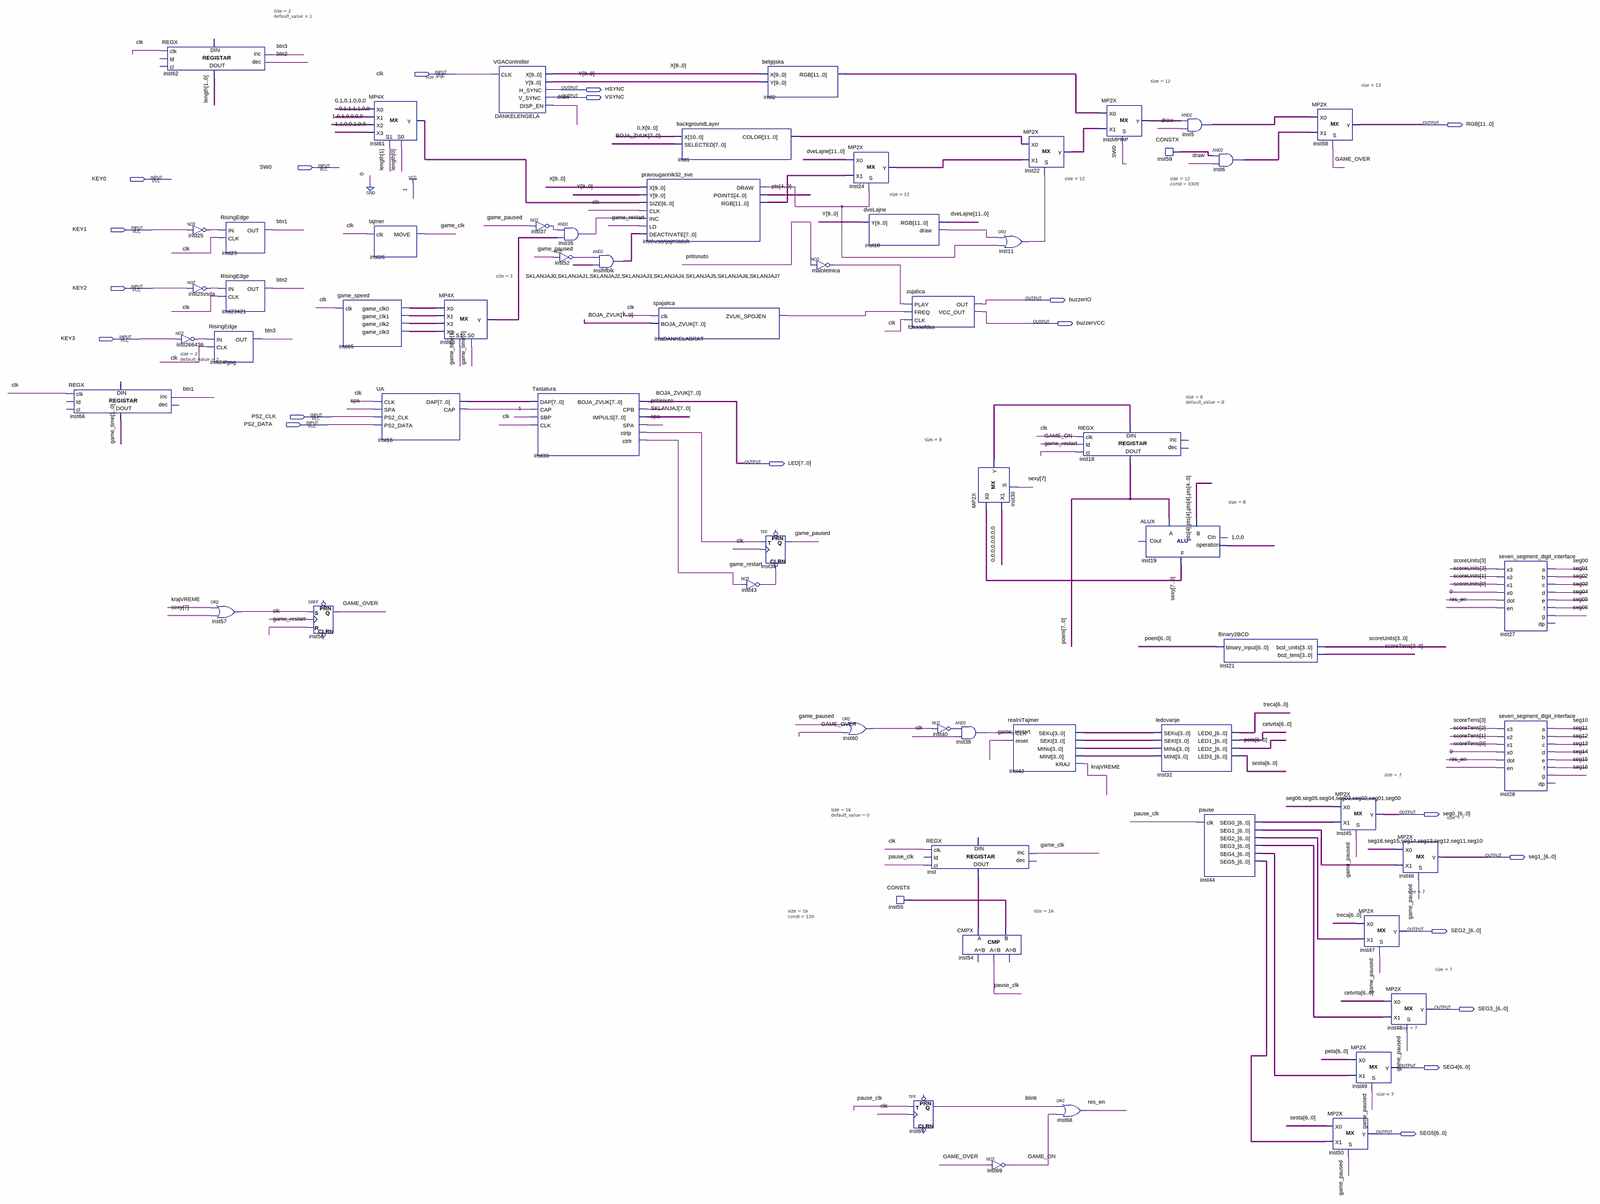
[diagram p0: schematic sheet, whole]
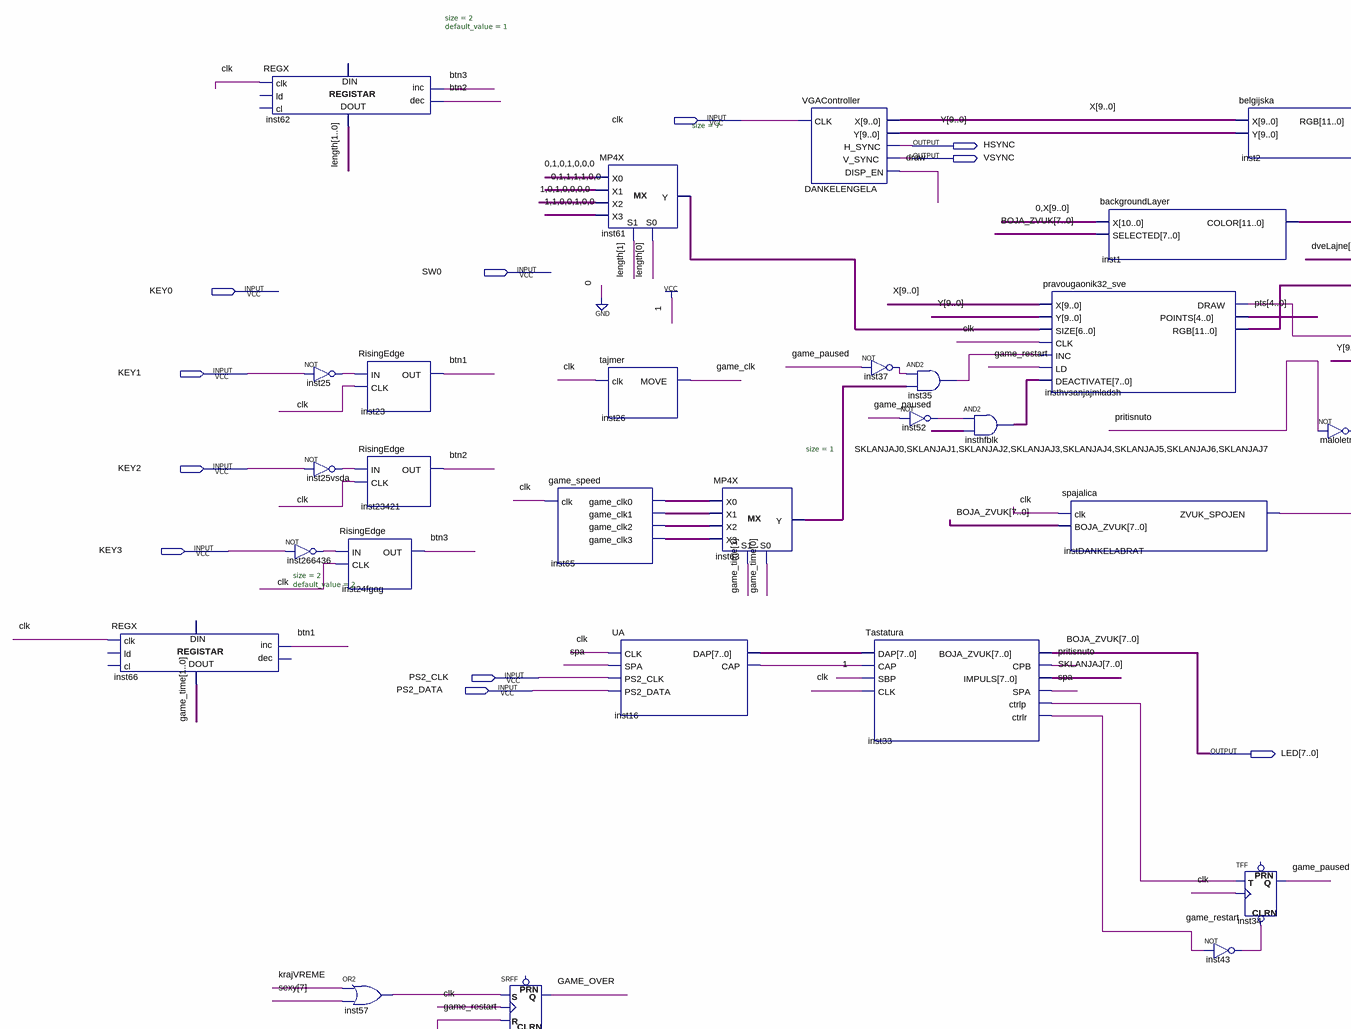
[diagram p1: schematic sheet, upper left part]
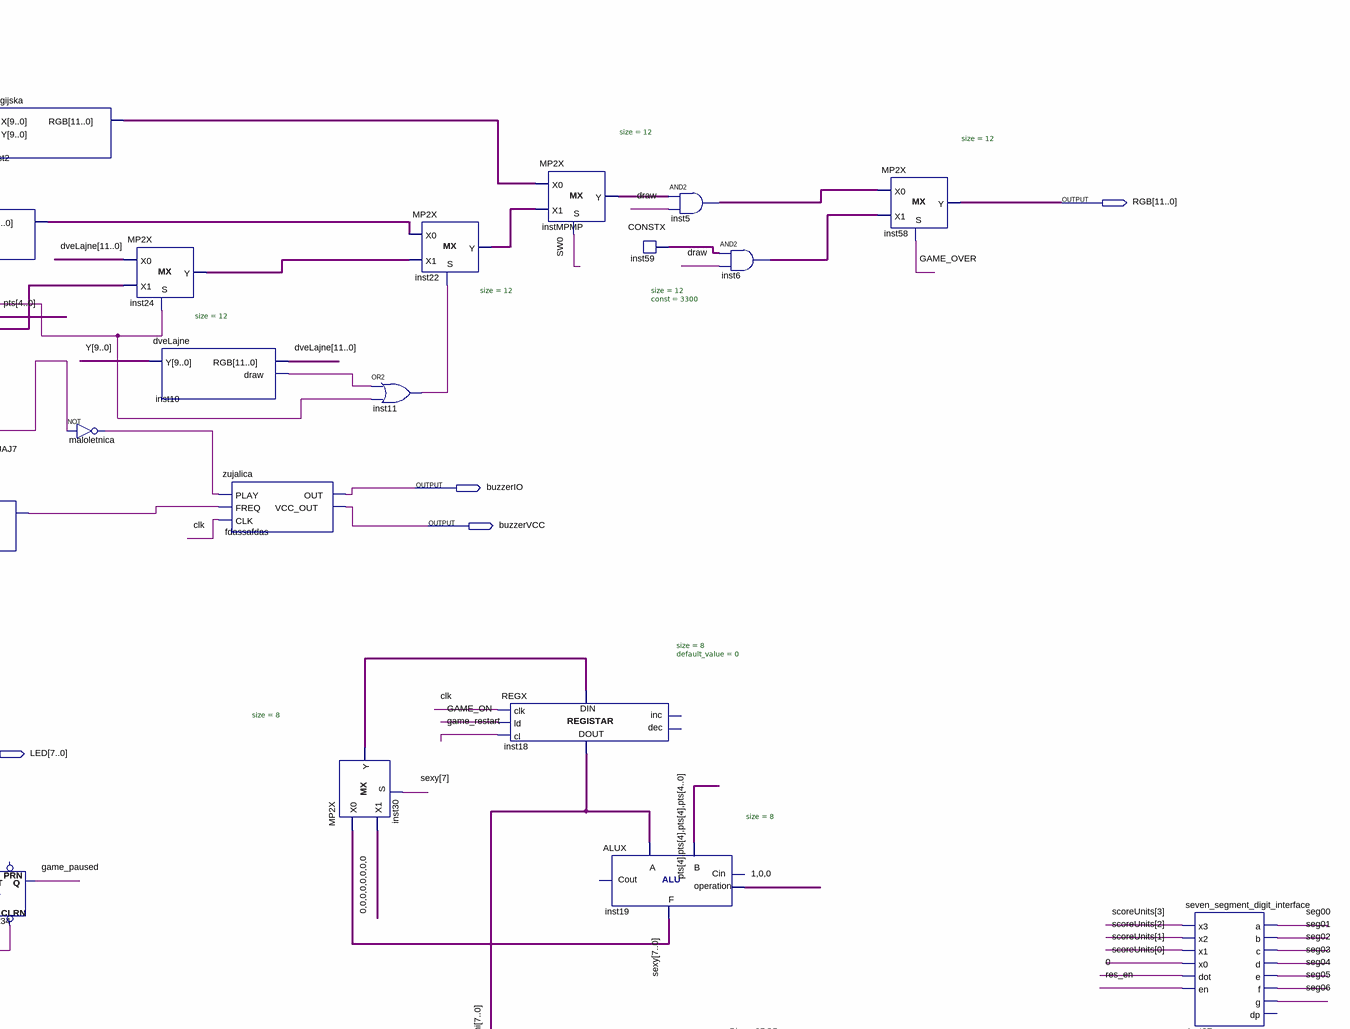
[diagram p2: schematic sheet, upper right part]
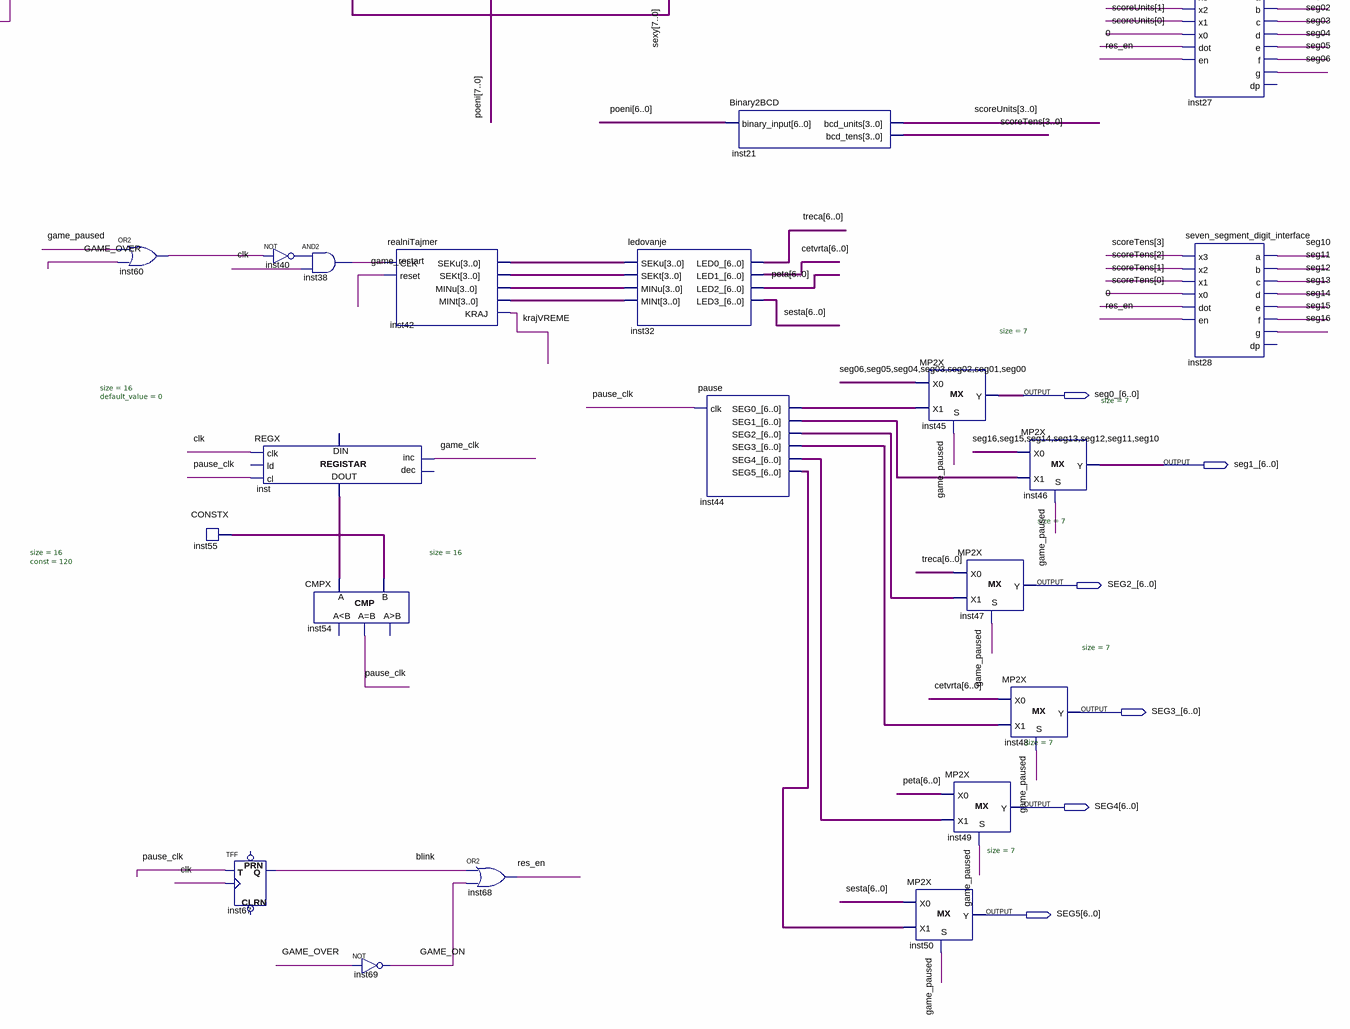
[diagram p3: schematic sheet, lower right part]
// Quartus schematic main.bdf as structural Verilog: 62 symbols, 20 pins
module main (
  input  clk,
  input  SW0,
  input  KEY0,
  input  KEY1,
  input  KEY2,
  input  KEY3,
  input  PS2_CLK,
  input  PS2_DATA,
  output HSYNC,
  output VSYNC,
  output [11:0] RGB,
  output buzzerIO,
  output buzzerVCC,
  output [7:0] LED,
  output [6:0] seg0_,
  output [6:0] seg1_,
  output [6:0] SEG2_,
  output [6:0] SEG3_,
  output [6:0] SEG4,
  output [6:0] SEG5
);

  wire blink, btn1, btn2, btn3, draw, game_clk, GAME_ON, GAME_OVER, game_paused, game_restart, inst10_draw,
       inst11_out, inst16_cap, inst25_out, inst25vsda_out, inst33_ctrlp, inst35_out, inst37_out, inst38_out,
       inst40_out, inst43_out, inst52_out, inst57_out, inst60_out, inst63_y, inst65_game_clk0,
       inst65_game_clk1, inst65_game_clk2, inst65_game_clk3, inst266436_out, instDANKELABRAT_zvuk_spojen,
       insthvsanjajmladsh_draw, krajVREME, maloletnica_out, pause_clk, pritisnuto, res_en, seg00, seg01,
       seg02, seg03, seg04, seg05, seg06, seg10, seg11, seg12, seg13, seg14, seg15, seg16, spa;
  wire [1:0] game_time, length;
  wire [3:0] inst42_mint, inst42_minu, inst42_sekt, inst42_seku, scoreTens, scoreUnits;
  wire [4:0] pts;
  wire [6:0] cetvrta, inst44_seg0_, inst44_seg1_, inst44_seg2_, inst44_seg3_, inst44_seg4_, inst44_seg5_,
       inst61_y, peta, sesta, treca;
  wire [7:0] inst16_dap, inst30_y, insthfblk_out, poeni, sexy, SKLANJAJ;
  wire [9:0] X, Y;
  wire [11:0] dveLajne, inst1_color, inst2_rgb, inst5_out, inst6_out, inst22_y, inst24_y, inst59_data,
       insthvsanjajmladsh_rgb, instMPMP_y;
  wire [15:0] inst55_data, inst_data_out;

  REGX #(.size(2), .default_value(2)) inst66 (
    .clk(clk), .inc(btn1), .data_out(game_time));  // open: ld, cl, dec, data_in
  REGX #(.size(2), .default_value(1)) inst62 (
    .clk(clk), .inc(btn3), .dec(btn2), .data_out(length));  // open: ld, cl, data_in
  not inst25 (inst25_out, KEY1);
  not inst25vsda (inst25vsda_out, KEY2);
  not inst266436 (inst266436_out, KEY3);
  RisingEdge inst23 (.IN(inst25_out), .CLK(clk), .OUT(btn1));
  RisingEdge inst23421 (.IN(inst25vsda_out), .CLK(clk), .OUT(btn2));
  RisingEdge inst24fgag (.IN(inst266436_out), .CLK(clk), .OUT(btn3));
  or inst57 (inst57_out, krajVREME, sexy[7]);
  SRFF inst56 (.S(inst57_out), .R(game_restart), .CLK(clk), .Q(GAME_OVER));  // open: PRN, CLRN
  game_speed inst65 (
    .clk(clk), .game_clk0(inst65_game_clk0), .game_clk1(inst65_game_clk1), .game_clk2(inst65_game_clk2),
    .game_clk3(inst65_game_clk3));
  MP4X #(.size(7)) inst61 (
    .S0(length[0]), .S1(length[1]), .X0(7'b0101000), .X1(7'b0111100), .X2(7'b1010000), .X3(7'b1100100),
    .Y(inst61_y));
  tajmer inst26 (.clk(clk), .MOVE(game_clk));
  UA inst16 (.CLK(clk), .SPA(spa), .PS2_CLK(PS2_CLK), .PS2_DATA(PS2_DATA), .DAP(inst16_dap), .CAP(inst16_cap));
  MP4X #(.size(1)) inst63 (
    .S0(game_time[0]), .S1(game_time[1]), .X0(inst65_game_clk0), .X1(inst65_game_clk1),
    .X2(inst65_game_clk2), .X3(inst65_game_clk3), .Y(inst63_y));
  VGAController DANKELENGELA (.CLK(clk), .X(X), .Y(Y), .H_SYNC(HSYNC), .V_SYNC(VSYNC), .DISP_EN(draw));
  not inst37 (inst37_out, game_paused);
  Tastatura inst33 (
    .DAP(inst16_dap), .CAP(inst16_cap), .SBP(1'b1), .CLK(clk), .BOJA_ZVUK(LED), .CPB(pritisnuto),
    .IMPULS(SKLANJAJ), .SPA(spa), .ctrlp(inst33_ctrlp), .ctrlr(game_restart));
  and inst35 (inst35_out, inst37_out, inst63_y);
  not inst52 (inst52_out, game_paused);
  assign insthfblk_out = {8{inst52_out}} & {SKLANJAJ[0], SKLANJAJ[1], SKLANJAJ[2], SKLANJAJ[3], SKLANJAJ[4], SKLANJAJ[5], SKLANJAJ[6], SKLANJAJ[7]};  // AND2 insthfblk, 8 bits wide
  pravougaonik32_sve insthvsanjajmladsh (
    .X(X), .Y(Y), .SIZE(inst61_y), .CLK(clk), .INC(inst35_out), .LD(game_restart),
    .DEACTIVATE(insthfblk_out), .DRAW(insthvsanjajmladsh_draw), .POINTS(pts), .RGB(insthvsanjajmladsh_rgb));
  spajalica instDANKELABRAT (.clk(clk), .BOJA_ZVUK(LED), .ZVUK_SPOJEN(instDANKELABRAT_zvuk_spojen));
  backgroundLayer inst1 (.X({1'b0, X}), .SELECTED(LED), .COLOR(inst1_color));
  belgijska inst2 (.X(X), .Y(Y), .RGB(inst2_rgb));
  TFF inst34 (.CLRN(inst43_out), .T(inst33_ctrlp), .CLK(clk), .Q(game_paused));  // open: PRN
  not inst43 (inst43_out, game_restart);
  not maloletnica (maloletnica_out, pritisnuto);
  MP2X #(.size(12)) inst24 (.S(insthvsanjajmladsh_draw), .X0(dveLajne), .X1(insthvsanjajmladsh_rgb), .Y(inst24_y));
  or inst60 (inst60_out, game_paused, GAME_OVER);
  dveLajne inst10 (.Y(Y), .RGB(dveLajne), .draw(inst10_draw));
  CONSTX #(.size(16), .\const (120)) inst55 (.data(inst55_data));
  zujalica fdassafdas (
    .PLAY(maloletnica_out), .FREQ(instDANKELABRAT_zvuk_spojen), .CLK(clk), .OUT(buzzerIO), .VCC_OUT(buzzerVCC));
  TFF inst67 (.T(pause_clk), .CLK(clk), .Q(blink));  // open: PRN, CLRN
  not inst40 (inst40_out, inst60_out);
  REGX #(.size(16), .default_value(0)) inst (
    .clk(clk), .cl(pause_clk), .inc(game_clk), .data_out(inst_data_out));  // open: ld, dec, data_in
  MP2X #(.size(8)) inst30 (.S(sexy[7]), .X0(sexy), .X1({8{1'b0}}), .Y(inst30_y));
  and inst38 (inst38_out, inst40_out, clk);
  CMPX #(.size(16)) inst54 (.A(inst_data_out), .B(inst55_data), .eq(pause_clk));  // open: ls, gr
  or inst11 (inst11_out, inst10_draw, insthvsanjajmladsh_draw);
  realniTajmer inst42 (
    .CLK(inst38_out), .reset(game_restart), .SEKu(inst42_seku), .SEKt(inst42_sekt), .MINu(inst42_minu),
    .MINt(inst42_mint), .KRAJ(krajVREME));
  not inst69 (GAME_ON, GAME_OVER);
  MP2X #(.size(12)) inst22 (.S(inst11_out), .X0(inst1_color), .X1(inst24_y), .Y(inst22_y));
  REGX #(.size(8), .default_value(0)) inst18 (
    .clk(clk), .ld(GAME_ON), .cl(game_restart), .data_in(inst30_y), .data_out(poeni));  // open: inc, dec
  or inst68 (res_en, blink, GAME_ON);
  MP2X #(.size(12)) instMPMP (.S(SW0), .X0(inst2_rgb), .X1(inst22_y), .Y(instMPMP_y));
  ALUX #(.size(8)) inst19 (.B({{4{pts[4]}}, pts[3:0]}), .A(poeni), .op(3'b100), .F(sexy));  // open: Cin, Cout
  CONSTX #(.size(12), .\const (3300)) inst59 (.data(inst59_data));
  ledovanje inst32 (
    .SEKu(inst42_seku), .SEKt(inst42_sekt), .MINu(inst42_minu), .MINt(inst42_mint), .LED0_(treca),
    .LED1_(cetvrta), .LED2_(peta), .LED3_(sesta));
  assign inst5_out = instMPMP_y & {12{draw}};  // AND2 inst5, 12 bits wide
  pause inst44 (
    .clk(pause_clk), .SEG0_(inst44_seg0_), .SEG1_(inst44_seg1_), .SEG2_(inst44_seg2_), .SEG3_(inst44_seg3_),
    .SEG4_(inst44_seg4_), .SEG5_(inst44_seg5_));
  assign inst6_out = inst59_data & {12{draw}};  // AND2 inst6, 12 bits wide
  Binary2BCD inst21 (.binary_input(poeni[6:0]), .bcd_units(scoreUnits), .bcd_tens(scoreTens));
  MP2X #(.size(12)) inst58 (.S(GAME_OVER), .X0(inst5_out), .X1(inst6_out), .Y(RGB));
  MP2X #(.size(7)) inst50 (.S(game_paused), .X0(sesta), .X1(inst44_seg5_), .Y(SEG5));
  MP2X #(.size(7)) inst45 (
    .S(game_paused), .X0({seg06, seg05, seg04, seg03, seg02, seg01, seg00}), .X1(inst44_seg0_), .Y(seg0_));
  MP2X #(.size(7)) inst47 (.S(game_paused), .X0(treca), .X1(inst44_seg2_), .Y(SEG2_));
  MP2X #(.size(7)) inst49 (.S(game_paused), .X0(peta), .X1(inst44_seg4_), .Y(SEG4));
  MP2X #(.size(7)) inst48 (.S(game_paused), .X0(cetvrta), .X1(inst44_seg3_), .Y(SEG3_));
  MP2X #(.size(7)) inst46 (
    .S(game_paused), .X0({seg16, seg15, seg14, seg13, seg12, seg11, seg10}), .X1(inst44_seg1_), .Y(seg1_));
  seven_segment_digit_interface inst27 (
    .x3(scoreUnits[3]), .x2(scoreUnits[2]), .x1(scoreUnits[1]), .x0(scoreUnits[0]), .dot(1'b0), .en(res_en),
    .a(seg00), .b(seg01), .c(seg02), .d(seg03), .e(seg04), .f(seg05), .g(seg06));  // open: dp
  seven_segment_digit_interface inst28 (
    .x3(scoreTens[3]), .x2(scoreTens[2]), .x1(scoreTens[1]), .x0(scoreTens[0]), .dot(1'b0), .en(res_en),
    .a(seg10), .b(seg11), .c(seg12), .d(seg13), .e(seg14), .f(seg15), .g(seg16));  // open: dp

  // Other names for the same wires on the sheet: BOJA_ZVUK[7:0] = LED
endmodule
